# EAGLE design UI Adapter SMD (EAGLE 9.6.0)

## Sheet 1 of 2
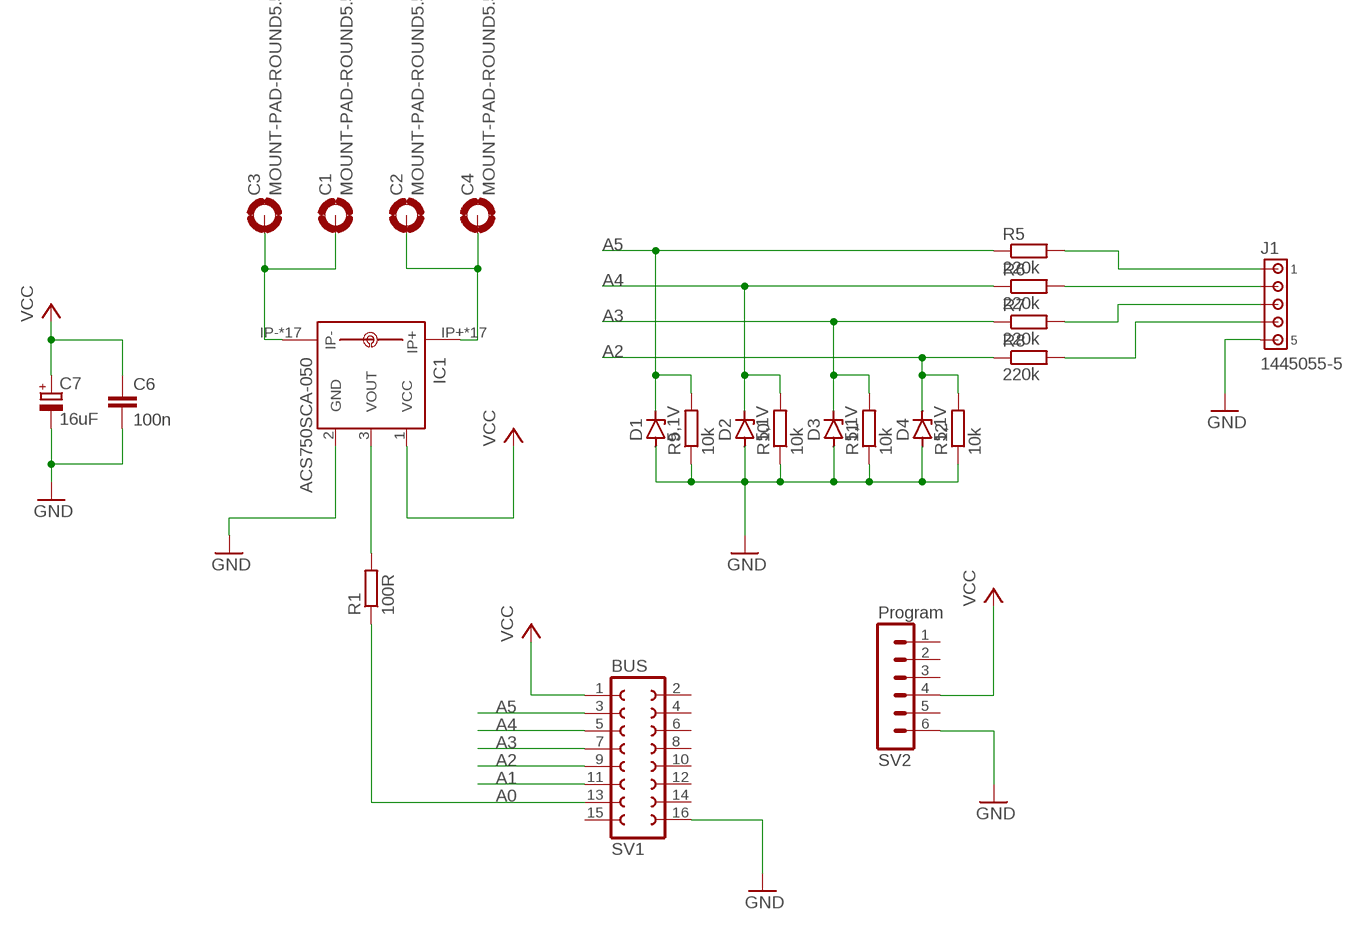
[diagram p0: schematic, sheet 1]

### Parts
C1  MOUNT-PAD-ROUND5.5  [5,5-PAD]
C2  MOUNT-PAD-ROUND5.5  [5,5-PAD]
C3  MOUNT-PAD-ROUND5.5  [5,5-PAD]
C4  MOUNT-PAD-ROUND5.5  [5,5-PAD]
C6  100n  C-EUC0402K  [C0402K]
C7  16uF  CPOL-EUA/3216-18W  [A/3216-18W]
D1  5,1V  ZENER-DIODESOD80C  [SOD80C]
D2  5,1V  ZENER-DIODESOD80C  [SOD80C]
D3  5,1V  ZENER-DIODESOD80C  [SOD80C]
D4  5,1V  ZENER-DIODESOD80C  [SOD80C]
IC1  ACS750SCA-050  [ACS75050]
J1  1445055-5  [1445055-5]
R1  100R  R-EU_R0402  [R0402]
R5  220k  R-EU_R0402  [R0402]
R6  220k  R-EU_R0402  [R0402]
R7  220k  R-EU_R0402  [R0402]
R8  220k  R-EU_R0402  [R0402]
R9  10k  R-EU_R0402  [R0402]
R10  10k  R-EU_R0402  [R0402]
R11  10k  R-EU_R0402  [R0402]
R12  10k  R-EU_R0402  [R0402]
SV1  BUS  FE08-2  [FE08-2]
SV2  Program  MA06-1  [MA06-1]

### Nets
A0: R1.1 SV1.13
A1: SV1.11
A2: D4.C R8.1 R12.2 SV1.9
A3: D3.C R7.1 R11.2 SV1.7
A4: D2.C R6.1 R10.2 SV1.5
A5: D1.C R5.1 R9.2 SV1.3
C1: C1.B5,5(MOUNT) C3.B5,5(MOUNT) IC1.IP- IC1.IP-@2(IP-) IC1.IP-@3(IP-) IC1.IP-@4(IP-) IC1.IP-@5(IP-) IC1.IP-@6(IP-) IC1.IP-@7(IP-) IC1.IP-@8(IP-) IC1.IP-@9(IP-) IC1.IP-@10(IP-) IC1.IP-@11(IP-) IC1.IP-@12(IP-) IC1.IP-@13(IP-) IC1.IP-@14(IP-) IC1.IP-@15(IP-) IC1.IP-@16(IP-) IC1.IP-@17(IP-)
C2: C2.B5,5(MOUNT) C4.B5,5(MOUNT) IC1.IP+ IC1.IP+@2(IP+) IC1.IP+@3(IP+) IC1.IP+@4(IP+) IC1.IP+@5(IP+) IC1.IP+@6(IP+) IC1.IP+@7(IP+) IC1.IP+@8(IP+) IC1.IP+@9(IP+) IC1.IP+@10(IP+) IC1.IP+@11(IP+) IC1.IP+@12(IP+) IC1.IP+@13(IP+) IC1.IP+@14(IP+) IC1.IP+@15(IP+) IC1.IP+@16(IP+) IC1.IP+@17(IP+)
GND: C6.2 C7.- D1.A D2.A D3.A D4.A IC1.2(GND) J1.5 R9.1 R10.1 R11.1 R12.1 SV1.16 SV2.6
N$3: IC1.3(VOUT) R1.2
N$8: J1.1 R5.2
N$9: J1.2 R6.2
N$10: J1.3 R7.2
N$11: J1.4 R8.2
VCC: C6.1 C7.+ IC1.1(VCC) SV1.1 SV2.4
Unconnected: SV1.2 SV1.4 SV1.6 SV1.8 SV1.10 SV1.12 SV1.14 SV1.15 SV2.1 SV2.2 SV2.3 SV2.5

## Sheet 2 of 2

## Library data of the parts
C1-C4 = holes:MOUNT-PAD-ROUND: MOUNTING PAD, round
C6 = rcl:C-EU: CAPACITOR, European symbol; SPICEPREFIX: C
C7 = rcl:CPOL-EU: POLARIZED CAPACITOR, European symbol; SPICEPREFIX: C
D1-D4 = diode:ZENER-DIODE: Z-Diode
IC1 = allegro:ACS750*CA-050: Current Sensor display layer 49 Reference in BRD and place VIAs on circles Source: www.allegromicro.com/datafile/0750-050.pdf; MF: ALLEGRO MICROSYSTEMS, INC.; MPN: ACS750SCA-050; OC_FARNELL: 1457175; OC_NEWARK: 81H6588
J1 = con-amp:1445055-5: Micro MATE-N-LOK Connectors grid 1.5 mm Source: ENG_CD_1445055_A.pdf
R1 R5-R12 = rcl:R-EU_: RESISTOR, European symbol; SPICEPREFIX: R
SV1 = con-lsta:FE08-2: FEMALE HEADER; OC_FARNELL: unknown; OC_NEWARK: unknown
SV2 = con-lstb:MA06-1: PIN HEADER; OC_FARNELL: unknown; OC_NEWARK: unknown

## Board
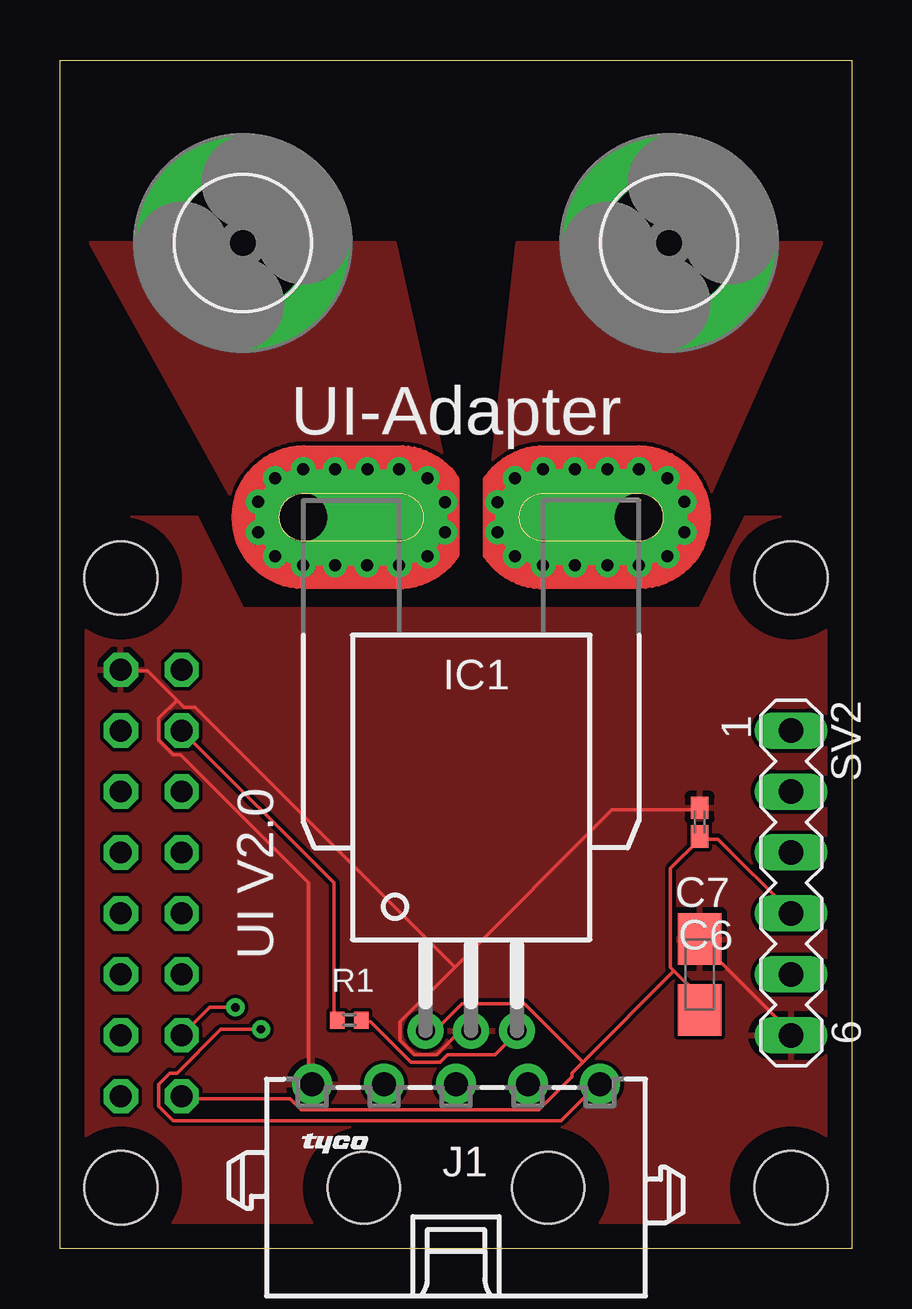
[diagram p1: board, top side]
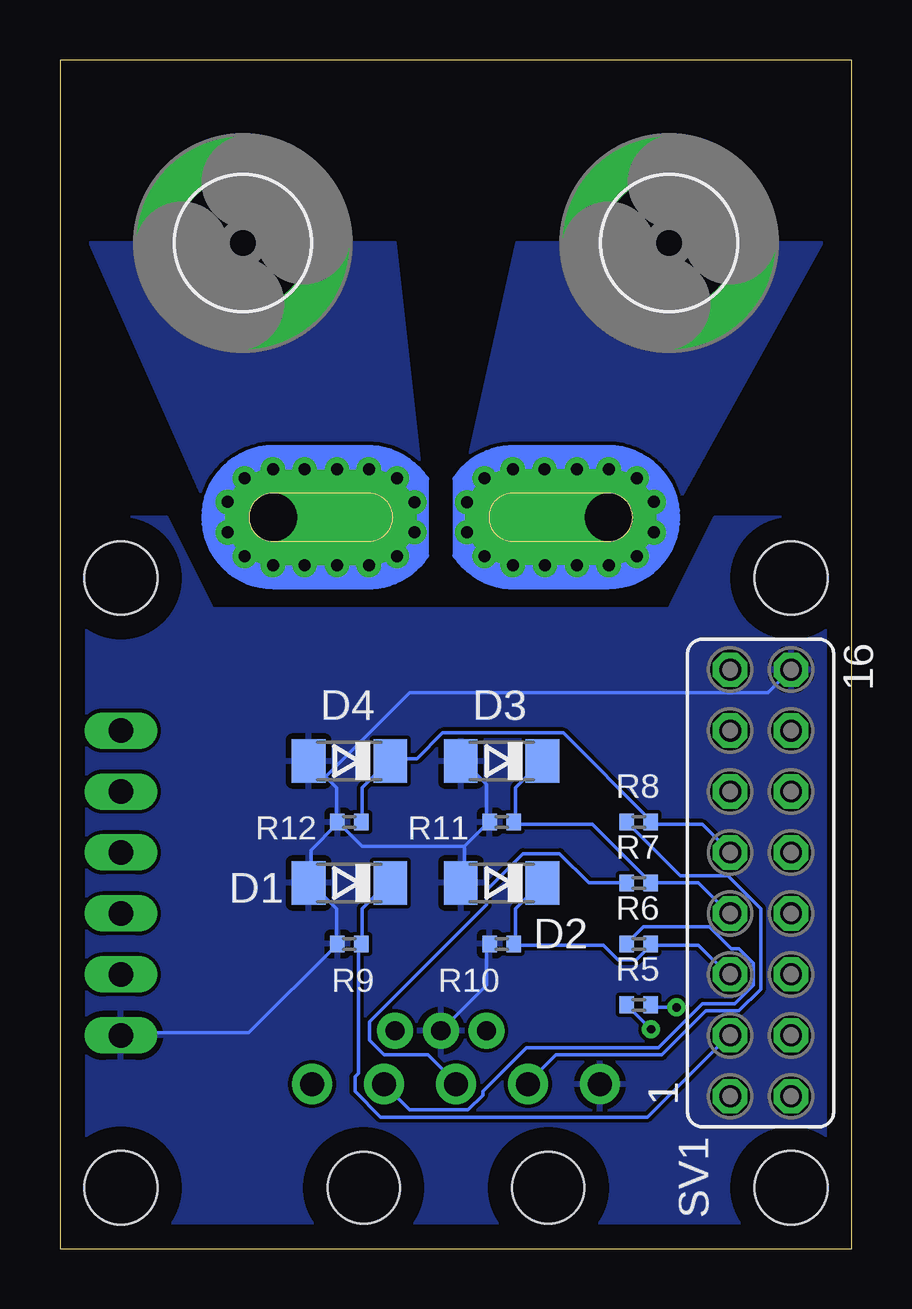
[diagram p2: board, bottom side, seen from below]

Size 33.02 x 49.53 mm. Coordinates in mm from the lower left corner, seen from the top.
Outline: 0,0 0,49.53 33.02,49.53 33.02,0 0,0
Copper layers (1*16): Top 0.035mm / dielectric 1.5mm / Bottom 0.035mm
Design rules "default": minimum track width 6mil, minimum drill 0.35mm, track to track 6mil, track to pad 6mil, pad to pad 6mil, via to via 6mil, smd to smd 6mil, copper to edge 40mil, drill to drill 6mil, minimum pad ring 10mil, minimum via ring 8mil, stop-mask expansion 4mil, vias tented up to drill 0mil, thermal gap 10mil
Holes 3.05 mm at 2.54,27.94 2.54,2.54 30.48,27.94 30.48,2.54

### Footprints (pad centres in the part's own frame; a part is rotated, then mirrored left to right if it is on the bottom)
5,5-PAD = drill 5.5 pad 9: B5,5 0,0
C0402K = smd 0.925 x 0.74: 1 -0.6,0; 2 0.6,0
A/3216-18W = smd 2.15 x 1.8: + 1.475,0; - -1.475,0
SOD80C = smd 1.4 x 1.8: A 1.7,0; C -1.7,0
ACS75050 = drill 0.8 pad 1.5: 1 -1.91,-21.4; 2 0,-21.4; 3 1.91,-21.4 | drill 2 pad 4 offset: IP+ 7,0; IP- -7,0 | drill 0.5 pad 0.9: IP+@2 8.89,-0.635; IP+@3 8.89,0.635; IP+@4 8.175,1.625; IP+@5 7,2; IP+@6 5.675,2; IP+@7 4.325,2; IP+@8 3,2; IP+@9 1.825,1.625; IP+@10 1.1,0.625; IP+@11 1.1,-0.625; IP+@12 1.825,-1.625; IP+@13 3,-2; IP+@14 4.325,-2; IP+@15 5.675,-2; IP+@16 7,-2; IP+@17 8.175,-1.625; IP-@2 -8.89,-0.635; IP-@3 -8.89,0.635; IP-@4 -8.175,1.625; IP-@5 -7,2; IP-@6 -5.675,2; IP-@7 -4.325,2; IP-@8 -3,2; IP-@9 -1.825,1.625; IP-@10 -1.1,0.625; IP-@11 -1.1,-0.625; IP-@12 -1.825,-1.625; IP-@13 -3,-2; IP-@14 -4.35,-2; IP-@15 -5.675,-2; IP-@16 -7,-2; IP-@17 -8.175,-1.625
1445055-5 = drill 1 pad 1.676: 1 6,4.32; 2 3,4.32; 3 0,4.32; 4 -3,4.32; 5 -6,4.32 | hole 3: -3.85,0; 3.85,0
R0402 = smd 0.6 x 0.7: 1 -0.5,0; 2 0.5,0
FE08-2 = drill 0.914 octagon: 1 -8.89,1.27; 2 -8.89,-1.27; 3 -6.35,1.27; 4 -6.35,-1.27; 5 -3.81,1.27; 6 -3.81,-1.27; 7 -1.27,1.27; 8 -1.27,-1.27; 9 1.27,1.27; 10 1.27,-1.27; 11 3.81,1.27; 12 3.81,-1.27; 13 6.35,1.27; 14 6.35,-1.27; 15 8.89,1.27; 16 8.89,-1.27
MA06-1 = drill 1.016 long: 1 -6.35,0; 2 -3.81,0; 3 -1.27,0; 4 1.27,0; 5 3.81,0; 6 6.35,0

### Placement (x,y rotation side)
C1  7.62,41.91 0 top
C2  25.4,41.91 0 top
C3  7.62,41.91 0 bottom
C4  25.4,41.91 0 bottom
C6  26.67,17.78 90 top
C7  26.67,11.43 270 top
D1  20.95,15.24 180 bottom
D2  14.61,15.24 180 bottom
D3  14.61,20.32 180 bottom
D4  20.95,20.32 180 bottom
IC1  17.14,30.48 0 top
J1  16.51,2.54 0 top
R1  12.06,9.53 0 top
R5  8.89,10.16 180 bottom
R6  8.89,12.7 180 bottom
R7  8.89,15.24 180 bottom
R8  8.89,17.78 180 bottom
R9  20.95,12.7 0 bottom
R10  14.61,12.7 0 bottom
R11  14.61,17.78 0 bottom
R12  20.95,17.78 0 bottom
SV1  3.81,15.24 90 bottom
SV2  30.48,15.24 270 top

### Tracks (layer width: path | path; a pad name or v marks a point on that pad's centre or on a via)
A0
  Top 0.152: SV1.13 11.43,15.24 11.43,9.6 R1.1
A2
  Bottom 0.152: R12.2 20.42,17.83 20.42,19.2 19.36,20.27 D4.C 19.2,20.42 18.14,20.42 17.07,21.49 12.04,21.49 8.38,17.83 R8.1 8.38,17.68 6.25,17.68 SV1.9
A3
  Bottom 0.152: D3.C 12.95,20.27 14.02,19.2 14.02,17.83 R11.2 14.02,17.68 10.82,17.68 R7.1 | R7.1 6.4,15.24 5.18,14.02 SV1.7 | R7.1
A4
  Bottom 0.152: D2.C 12.95,15.24 14.02,14.17 14.02,12.8 R10.2 14.02,12.65 10.36,12.65 9.75,12.04 8.99,12.04 8.38,12.65 | 8.38,12.65 6.4,12.65 5.18,11.43 SV1.5 | 8.38,12.65 R6.1
A5  (via drill 0.35)
  Top 0.152: v7.32,10.06 6.25,10.06 SV1.3
  Bottom 0.152: D1.C 19.36,15.24 20.42,14.17 20.42,12.8 R9.2 20.57,12.65 20.57,7.32 20.73,7.16 20.73,6.55 19.66,5.49 8.53,5.49 5.18,8.84 SV1.3 | v7.32,10.06 8.38,10.06 R5.1
C1
  pour Top (no thermals): 7.62,30.48 1.27,41.91 13.97,41.91 16.51,30.48
  pour Bottom (no thermals): 7.62,30.48 1.27,41.91 13.97,41.91 16.51,30.48
C2
  pour Top (no thermals): 17.78,30.48 19.05,41.91 31.75,41.91 26.67,30.48
  pour Bottom (no thermals): 17.78,30.48 19.05,41.91 31.75,41.91 26.67,30.48
GND
  Top 0.152: C7.- 26.67,12.8 30.48,8.99 SV2.6 | 16.46,11.73 14.17,9.45 14.17,8.69 14.78,8.08 15.7,8.08 16.61,8.99 17.07,8.99 IC1.2 | 16.46,11.73 23.01,18.29 26.67,18.29 C6.2 | 4.88,22.86 5.18,22.55 5.64,22.55 16.46,11.73 | 4.88,22.86 3.66,24.08 2.59,24.08 SV1.16 | 4.88,22.86 4.12,22.1 4.12,21.18 4.72,20.57 5.03,20.57 10.36,15.24 10.36,7.01 J1.5
  Bottom 0.152: D3.A 16.15,20.27 15.24,19.36 15.24,17.83 R11.1 15.24,17.68 16.15,16.76 | 16.15,16.76 16.15,15.24 D2.A | 22.55,15.24 21.49,14.17 21.49,12.8 R9.1 21.49,12.65 25.15,8.99 30.48,8.99 SV2.6 | 21.95,19.66 22.55,20.27 D4.A | 21.95,19.66 21.49,19.2 21.49,17.83 R12.1 | 22.55,15.24 22.55,16.61 21.49,17.68 R12.1 | 22.55,15.24 D1.A | 16.15,16.76 20.42,16.76 21.34,17.68 R12.1 | R10.1 15.24,12.65 15.24,10.97 17.07,9.14 IC1.2 | 21.95,19.66 18.44,23.16 3.5,23.16 SV1.16
  pour Top: 33.02,0 0,0 0,30.48 5.71,30.48 7.62,26.67 26.67,26.67 28.57,30.48 33.02,30.48
  pour Bottom: 0,30.48 5.71,30.48 7.62,26.67 26.67,26.67 28.57,30.48 33.02,30.48 33.02,0 0,0
N$3
  Top 0.152: R1.2 12.65,9.45 12.95,9.45 14.63,7.77 15.85,7.77 16.15,8.08 18.14,8.08 19.05,8.99 IC1.3
N$8  (via drill 0.35)
  Top 0.152: v8.38,9.14 6.71,9.14 4.88,7.32 4.57,7.32 4.12,6.86 4.12,5.94 4.72,5.33 20.88,5.33 22.4,6.86 J1.1
  Bottom 0.152: v8.38,9.14 9.3,10.06 R5.2
N$9
  Bottom 0.152: R6.2 9.3,12.8 8.69,13.41 5.94,13.41 5.03,12.5 4.72,12.5 4.12,11.89 4.12,10.97 4.88,10.21 6.25,10.21 8.08,8.38 13.56,8.38 15.39,6.55 15.39,6.4 16,5.79 18.44,5.79 J1.2
N$10
  Bottom 0.152: R7.2 10.97,15.24 12.19,16.46 13.72,16.46 15.24,14.94 15.24,14.33 20.12,9.45 20.12,8.69 19.51,8.08 17.68,8.08 16.61,7.01 J1.3
N$11
  Bottom 0.152: R8.2 9.3,17.68 7.16,15.54 5.18,15.54 3.81,14.17 3.81,10.82 4.72,9.91 6.1,9.91 7.92,8.08 12.34,8.08 13.41,7.01 J1.4
VCC
  Top 0.152: 26.67,17.07 27.43,17.07 30.48,14.02 SV2.4 | C7.+ 26.67,10.52 25.6,11.58 | 25.6,11.58 25.45,11.73 25.45,15.85 26.67,17.07 | 26.67,17.07 C6.1 | 25.6,11.58 21.79,7.77 | 21.79,7.77 21.34,7.32 21.34,7.16 19.96,5.79 10.06,5.79 9.6,6.25 5.18,6.25 SV1.1 | 21.79,7.77 19.36,10.21 16.76,10.21 15.7,9.14 15.24,9.14 IC1.1

### Text on the board
tNames: UI-Adapter | UI V2.0